# Altium schematic sheet CAN.SchDoc
size A3; SheetNumber: 3; SheetTotal: 5
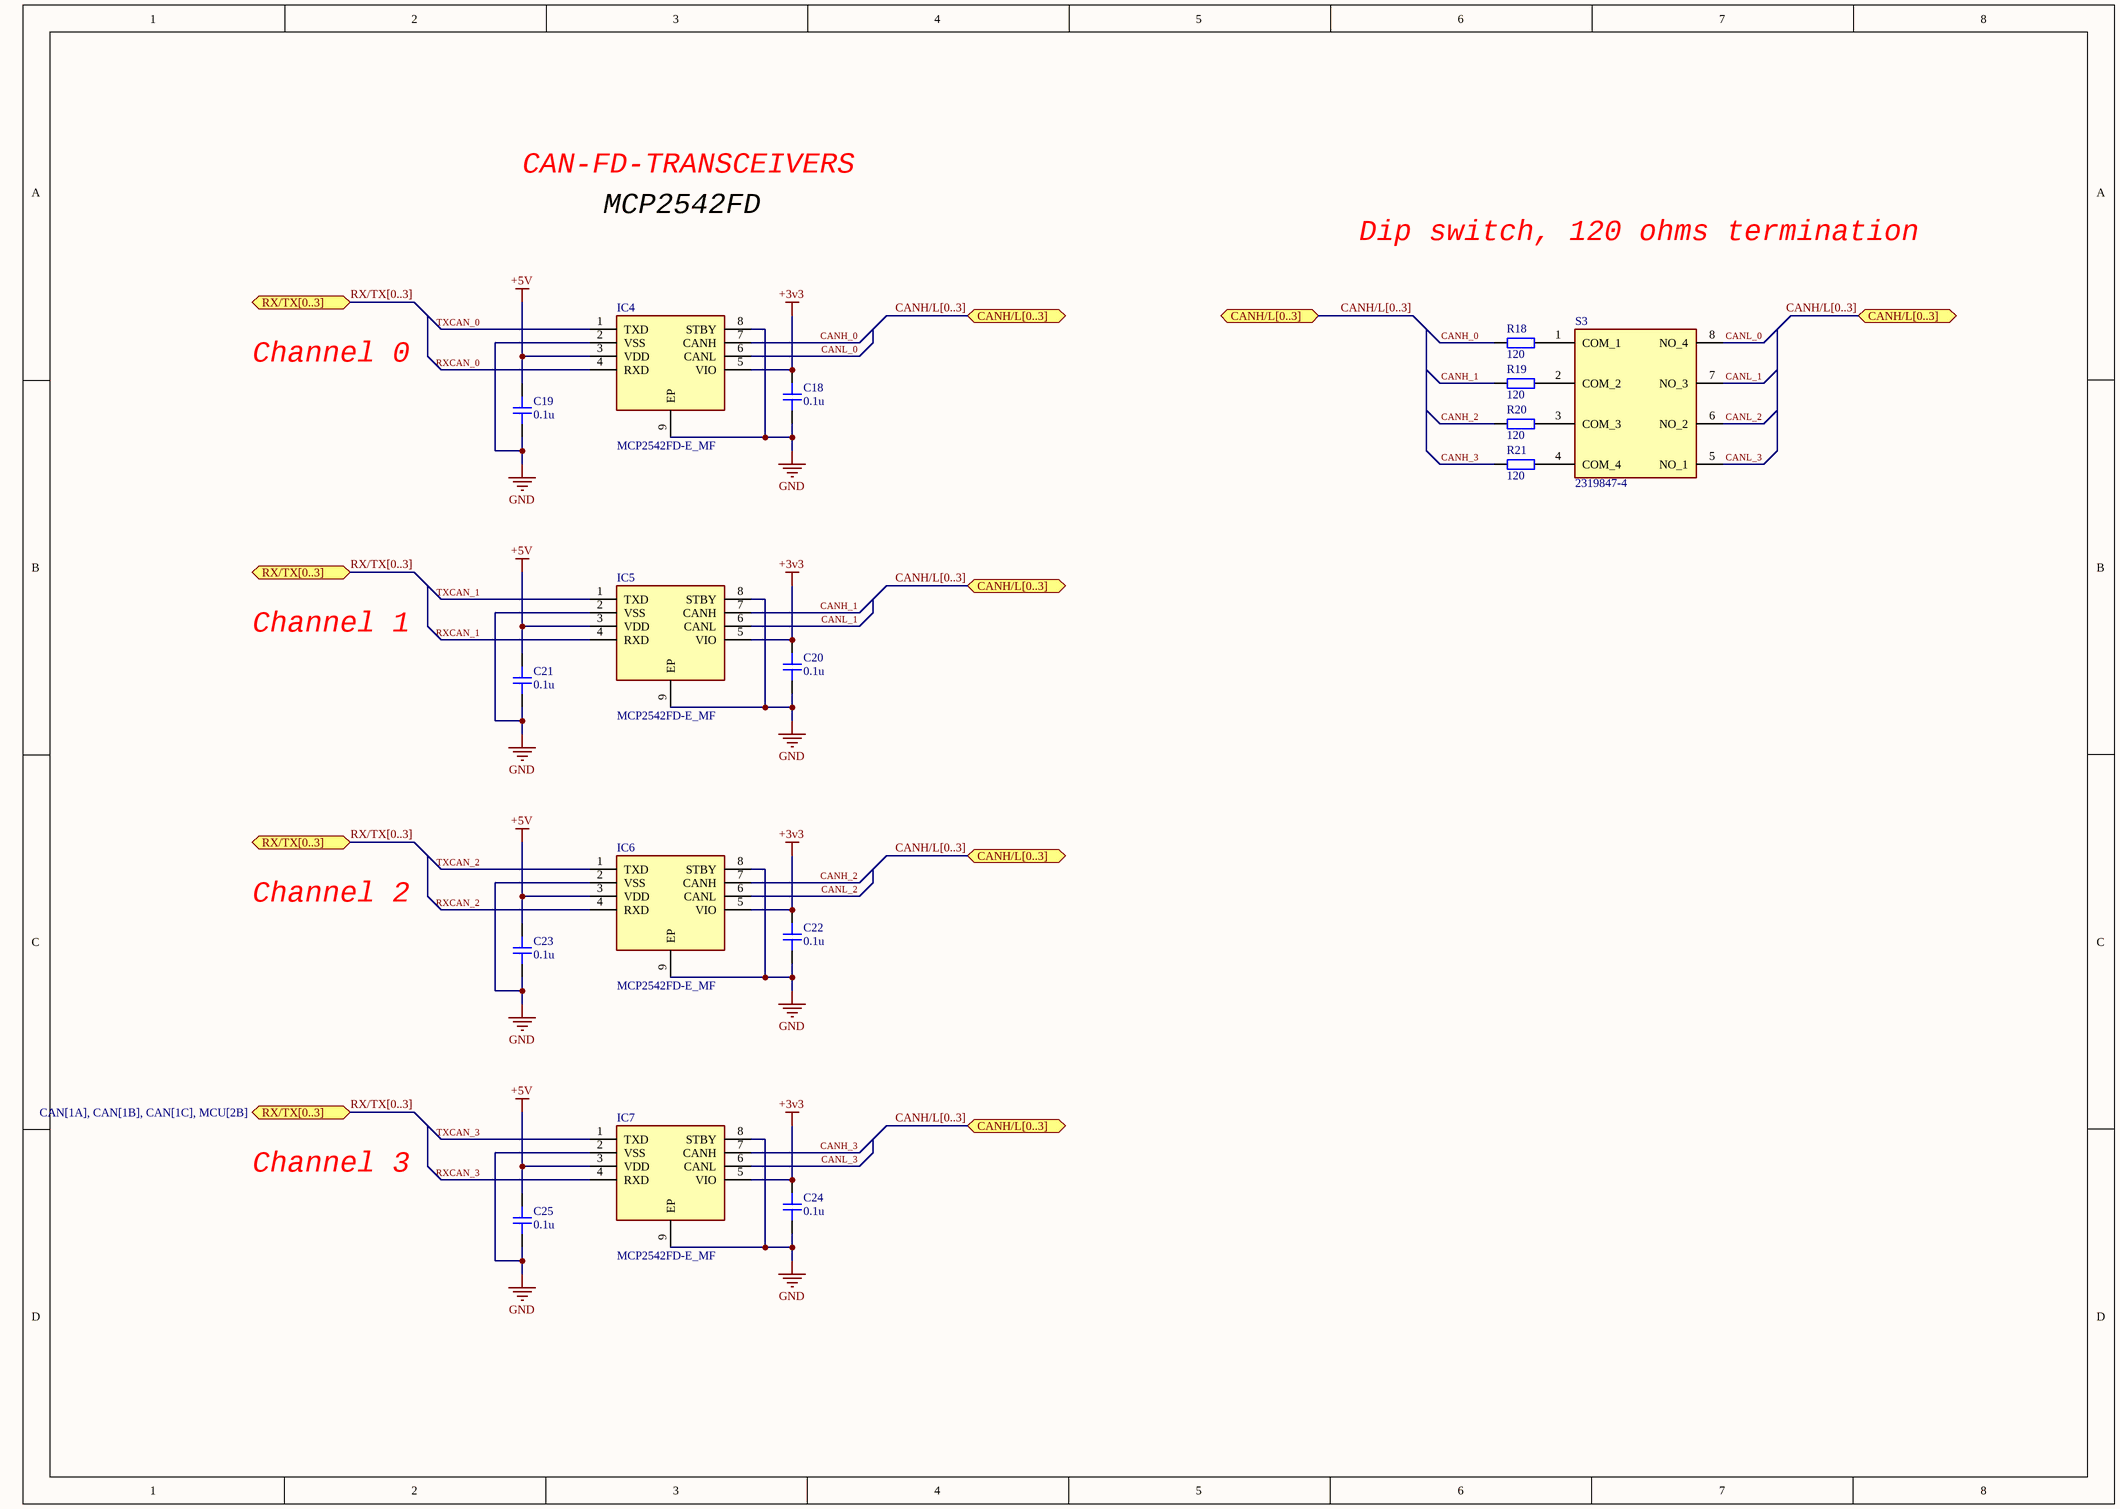
[diagram p0: CAN.SchDoc]

## Parts
C18  0.1u  [CAP_0805]
C19  0.1u  [CAP_0805]
C20  0.1u  [CAP_0805]
C21  0.1u  [CAP_0805]
C22  0.1u  [CAP_0805]
C23  0.1u  [CAP_0805]
C24  0.1u  [CAP_0805]
C25  0.1u  [CAP_0805]
IC4  MCP2542FD-E_MF  [SON65P300X300X100-9N-D]
IC5  MCP2542FD-E_MF  [SON65P300X300X100-9N-D]
IC6  MCP2542FD-E_MF  [SON65P300X300X100-9N-D]
IC7  MCP2542FD-E_MF  [SON65P300X300X100-9N-D]
R18  120  [RES_0805]
R19  120  [RES_0805]
R20  120  [RES_0805]
R21  120  [RES_0805]
S3  2319847-4  [23198474]

## Ports
CANH/L[0..3] (bidir, see CAN[4A], CAN[4B], CAN[4C], CAN[5A], CAN[8A], OUTPUTs[3B]), CANH/L[0..3] (bidir, see CAN[4A], CAN[4B], CAN[4C], CAN[5A], OUTPUTs[3B]), CANH/L[0..3] (bidir, see CAN[4A], CAN[4B], CAN[4C], CAN[8A], OUTPUTs[3B]), CANH/L[0..3] (bidir, see CAN[4A], CAN[4C], CAN[5A], CAN[8A], OUTPUTs[3B]), CANH/L[0..3] (bidir, see CAN[4B], CAN[4C], CAN[5A], CAN[8A], OUTPUTs[3B]), RX/TX[0..3] (bidir, see CAN[1A], CAN[1B], CAN[1C], MCU[2B]), RX/TX[0..3] (bidir, see CAN[1A], CAN[1C], MCU[2B]), RX/TX[0..3] (bidir, see CAN[1B], CAN[1C], MCU[2B])

## Nets
+3v3: C18.2 C20.2 C22.2 C24.2 IC4.5(VIO) IC5.5(VIO) IC6.5(VIO) IC7.5(VIO)
+5V: C19.2 C21.2 C23.2 C25.2 IC4.3(VDD) IC5.3(VDD) IC6.3(VDD) IC7.3(VDD)
GND: C18.1 C19.1 C20.1 C21.1 C22.1 C23.1 C24.1 C25.1 IC4.2(VSS) IC4.8(STBY) IC4.9(EP) IC5.2(VSS) IC5.8(STBY) IC5.9(EP) IC6.2(VSS) IC6.8(STBY) IC6.9(EP) IC7.2(VSS) IC7.8(STBY) IC7.9(EP)
CANH_0: IC4.7(CANH) R18.1
CANH_1: IC5.7(CANH) R19.1
CANH_2: IC6.7(CANH) R20.1
CANH_3: IC7.7(CANH) R21.1
CANL_0: IC4.6(CANL) S3.8(NO_4)
CANL_1: IC5.6(CANL) S3.7(NO_3)
CANL_2: IC6.6(CANL) S3.6(NO_2)
CANL_3: IC7.6(CANL) S3.5(NO_1)
RXCAN_0: IC4.4(RXD)
RXCAN_1: IC5.4(RXD)
RXCAN_2: IC6.4(RXD)
RXCAN_3: IC7.4(RXD)
TXCAN_0: IC4.1(TXD)
TXCAN_1: IC5.1(TXD)
TXCAN_2: IC6.1(TXD)
TXCAN_3: IC7.1(TXD)
NetR18_2: R18.2 S3.1(COM_1)
NetR19_2: R19.2 S3.2(COM_2)
NetR20_2: R20.2 S3.3(COM_3)
NetR21_2: R21.2 S3.4(COM_4)

## Buses and harness runs
bus CANH/L[0..3] = port CANH/L[0..3]
bus RX/TX[0..3] = port RX/TX[0..3]

## Notes on the sheet
- CAN-FD-TRANSCEIVERS
- MCP2542FD
- Dip switch, 120 ohms termination
- Channel 0
- Channel 1
- Channel 2
- Channel 3

## Library data of the parts
C18-C25 = CAP_0805_10V: Capacitor SMD 0805 10V
IC4-IC7 = MCP2542FD-E_MF: Integrated Circuit; Manufacturer_Name: Microchip; Manufacturer_Part_Number: MCP2542FD-E/MF; Datasheet Link: http://ww1.microchip.com/downloads/en/devicedoc/20005514a.pdf; Height: 1mm; Mouser Part Number: 579-MCP2542FD-E/MF; Mouser Price/Stock: https://www.mouser.co.uk/ProductDetail/Microchip-Technology-Atmel/MCP2542FD-E-MF?qs=l7cgNqFNU1jog4BwTzULBw%3D%3D; Arrow Part Number: MCP2542FD-E/MF; Arrow Price/Stock: https://www.arrow.com/en/products/mcp2542fd-emf/microchip-technology?region=nac
R18-R21 = RES_0805: Resistor SMD 0805
S3 = 2319847-4: Switch; Manufacturer_Name: TE Connectivity; Datasheet Link: https://www.te.com/commerce/DocumentDelivery/DDEController?Action=srchrtrv&DocNm=2319847&DocType=Customer+Drawing&DocLang=English&PartCntxt=2-2319847-4&DocFormat=pdf; Height: 3.7mm; Manufacturer_Part_Number: 2319847-4